# Altium project Xenoponics.PrjPcb
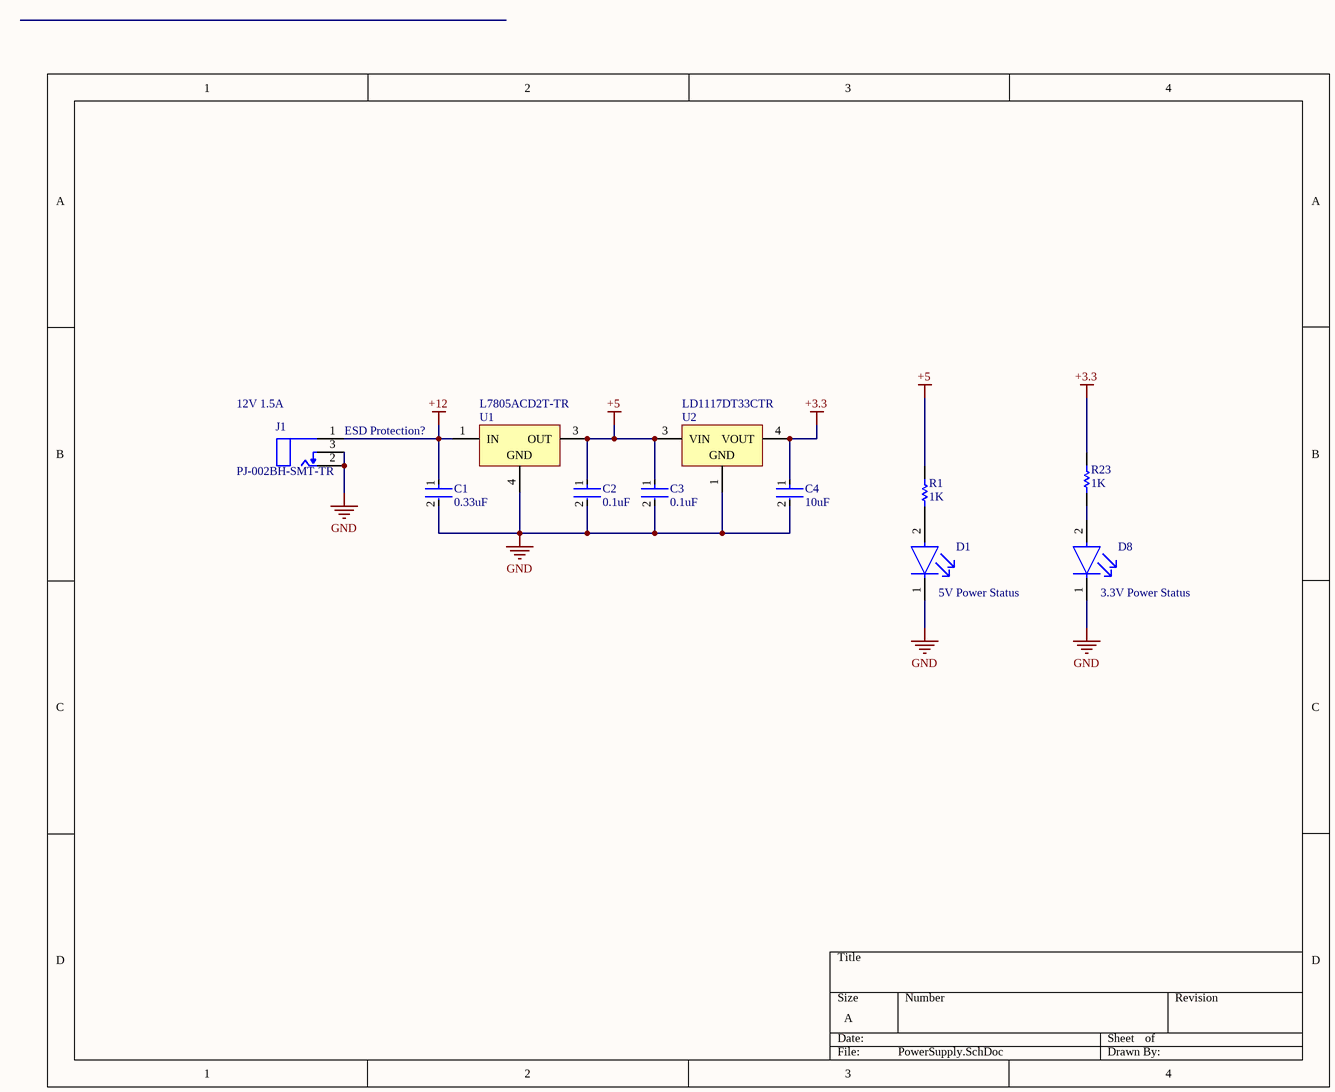
[diagram p0: PowerSupply.SchDoc]
5 sheets, 94 parts. Net scope: global (net labels, ports and power ports of the same name join across sheets).
Board file: Xenoponics.PcbDoc
Sheets:
  PowerSupply.SchDoc
  Processor.SchDoc
  MotorController.SchDoc
  TDS.SchDoc
  PH.SchDoc

## Sheet PowerSupply.SchDoc
size A; SheetNumber: 1; SheetTotal: 5

### Parts
C1  0.33uF  [FP-C0805C-DN-MFG]
C2  0.1uF  [FP-C0805C-DN-MFG]
C3  0.1uF  [FP-C0805C-DN-MFG]
C4  10uF  [FP-C0805C-DG-MFG]
D1  5V Power Status  [FP-LTST-C191TBKT-MFG]
D8  3.3V Power Status  [FP-LTST-C191TBKT-MFG]
J1  PJ-002BH-SMT-TR  [FP-PJ-002BH-SMT-TR-MFG]
R1  1K  [RESC2013X50X30NL20T20]
R23  1K  [RESC2013X50X30NL20T20]
U1  L7805ACD2T-TR  [TO-263_N]
U2  LD1117DT33CTR  [TO-252_M]

### Nets
+3.3: C4.1 R23.2 U2.4(VOUT)
+5: C2.1 C3.1 R1.2 U1.3(OUT) U2.3(VIN)
+12: C1.1 J1.1 U1.1(IN)
GND: C1.2 C2.2 C3.2 C4.2 D1.1(C) D8.1(C) J1.2 J1.3 U1.4(GND) U2.1(GND)
NetD1_2: D1.2(A) R1.1
NetD8_2: D8.2(A) R23.1

### Notes on the sheet
- (near J1) 12V 1.5A
- ESD Protection?

### Library data of the parts
C1 = CMP-1036-04607-3: CAP CER 0.33UF 50V X7R 0805; Manufacturer Part Number: C0805C334K5RACTU; Manufacturer: KEMET; Temperature Coefficient: 30ppm/°C; Value: 0.33 μF; Material: Ceramic; Tolerance: 0.1; Temperature: -55°C to +125°C; Temperature Range Low: -55°C; Voltage Rating: 50 V; Lead Free: Yes; Mouser Description: Multilayer Ceramic Capacitors MLCC - SMD/SMT 50volts 0.33uF 10% X7R; Automotive: No; Package: C0805C-DN; Temperature Characteristic: X7R; Capacitance: 0.33 μF; Digikey Description: CAP CER 0.33UF 50V X7R 0805; Device Class L3: Ceramic Capacitors; Temperature Range High: +125°C; Category: Cap; Ipc Land Pattern Name: CAPC200125X78; ComponentLink2URL: https://content.kemet.com/datasheets/KEM_C1003_C0G_SMD.pdf; ComponentLink2Description: Datasheet; RoHS: TRUE; Device Class L1: Passive Components; Height: 0.88mm; Octopart: https://octopart.com/c0805c334k5ractu-kemet-10475704; Device Class L2: Capacitors
C2 C3 = CMP-2007-00279-2: CAP CER 0.1UF 50V X7R 0805; Manufacturer Part Number: C0805C104K5RACTU; Manufacturer: KEMET; Value: 0.10 μF; Tolerance: 0.1; Temperature Coefficient: 30ppm/°C; Material: Ceramic; Device Class L2: Capacitors; Temperature Range Low: -55°C; Voltage Rating: 50 V; Digikey Description: CAP CER 0.1UF 50V X7R 0805; Category: Cap; ComponentLink2Description: Datasheet; Octopart: https://octopart.com/c0805c104k5ractu-kemet-143926; RoHS: TRUE; ComponentLink2URL: https://content.kemet.com/datasheets/KEM_C1003_C0G_SMD.pdf; Temperature Characteristic: X7R; Temperature: -55°C to +125°C; Height: 0.88mm; Temperature Range High: +125°C; Device Class L1: Passive Components; Automotive: No; Lead Free: Yes; Ipc Land Pattern Name: CAPC200125X78; Device Class L3: Ceramic Capacitors; Mouser Description: Cap Ceramic 0.1uF 50V X7R 10% SMD 2.0 x 1.2 mm 125 C Paper T/R; Capacitance: 0.10 μF; Package: C0805C-DN
C4 = CMP-2007-03243-2: CAP CER 10UF 10V X5R 0805; Manufacturer Part Number: C0805C106K8PACTU; Manufacturer: Kemet; 3DS Part Number: 220-00001; Tolerance: 10%; Temperature Coefficient: 15%; Material: Ceramic; Device Class L2: Capacitors; Device Class L1: Passive Components; ComponentLink2URL: https://content.kemet.com/datasheets/KEM_C1006_X5R_SMD.pdf; Height: 1.4mm; Lead Free: Yes; Digikey Description: CAP CER 10UF 10V X5R 0805; Octopart: https://octopart.com/c0805c106k8pactu-kemet-98697; Capacitance: 10uF; Value: 10uF; Temperature Range Low: -55°C; Temperature: -55°C to +85°C; Automotive: No; Mouser Description: CAP CER 10UF 10V X5R 0805; Ipc Land Pattern Name: CAPC200125X125; Temperature Range High: +85°C; Voltage: 10V; RoHS: TRUE; Device Class L3: Ceramic Capacitors; ComponentLink2Description: Datasheet; Voltage Rating: 10V; Package: C0805C-DG; Temperature Characteristic: X5R; Category: Cap
D1 = CMP-22017-000008-1: LED BLUE CLEAR CHIP SMD; Lens Color: Colorless; Dominant Wavelength: 475nm; Forward Current: 20mA; Wavelength: 468nm; Viewing Angle: 130°; Power Dissipation: 76mW; Luminous Intensity: 180mcd; Number of Elements: 1; Lens Style: Diffused; Forward Voltage: 3.8V; Max Power Dissipation: 75mW; Case Code (Metric): 1608; Packaging: Tape and Reel; Case/Package: 0603; Depth: 1.6mm; Mount: Surface Mount; Lead Free: Lead Free; Min Operating Temperature: -20°C; Lens Transparency: Clear; Illumination Color: Blue; Height: 0.55mm; Test Current: 20mA; Case Code (Imperial): 0603; Reverse Voltage: 5V; Max Operating Temperature: 80°C; Number of Pins: 2; Length: 0.8mm; Radiation Hardening: No; Package Quantity: 1; Number of LEDs: 1; Width: 0.8mm; Color: Blue
D8 = CMP-22017-000008-1: LED BLUE CLEAR CHIP SMD; Lens Color: Colorless; Dominant Wavelength: 475nm; Forward Current: 20mA; Wavelength: 468nm; Viewing Angle: 130°; Power Dissipation: 76mW; Luminous Intensity: 180mcd; Reverse Voltage: 5V; Number of Elements: 1; Lens Style: Diffused; Forward Voltage: 3.8V; Max Power Dissipation: 75mW; Case Code (Metric): 1608; Packaging: Tape and Reel; Case/Package: 0603; Depth: 1.6mm; Mount: Surface Mount; Lead Free: Lead Free; Min Operating Temperature: -20°C; Lens Transparency: Clear; Illumination Color: Blue; Height: 0.55mm; Test Current: 20mA; Case Code (Imperial): 0603; Max Operating Temperature: 80°C; Number of Pins: 2; Length: 0.8mm; Radiation Hardening: No; Package Quantity: 1; Number of LEDs: 1; Width: 0.8mm; Color: Blue
J1 = CMP-2000-06897-2: CONN PWR JACK 2.5X5.5MM SOLDER; Manufacturer: CUI Inc; Current Rating: 5A; Standoff Height: 0.1mm; Voltage Rating: 24V; Conn Gender: Male; Conn Orientation: Right Angle; Number Of Contacts: 3; Temperature Range Low: -25°C; Category: Conn; Package: 0; Device Class L2: Power Connectors; Contact Material: Nickel,Silver; Automotive: No; Mouser Description: 2.5 mm Center Pin, 5.0 A, Right Angle, Surface Mount (SMT), Dc Power Jack Connector; Device Class L3: unset; ComponentLink2URL: https://www.cuidevices.com/product/resource/digikeypdf/pj-002bh-smt-tr.pdf; Octopart: https://octopart.com/pj-002bh-smt-tr-cui-25947151; Manufacturer Part Number: PJ-002BH-SMT-TR; Lead Free: Yes; ComponentLink2Description: Datasheet; Digikey Description: CONN PWR JACK 2.5X5.5MM SOLDER; Height: 11.43mm; Temperature: -25°C to +85°C; RoHS: TRUE; Device Class L1: Connectors; Temperature Range High: +85°C
R1 R23 = CMP-1013-00510-2: Part Number: CRCW08051K00FKEA; Manufacturer: Vishay Dale
U1 = CMP-0244-00214-1: Positive Voltage Regulator, 3-Pin D2PAK, Tape and Reel; DatasheetVersion: 16/11/2011; PackageVersion: 2011; PackageReference: TO-263; PackageDescription: 3-Pin Transistor Outline Package 2.54 mm Pitch, 15.4 mm Lead Span (D2PAK); ComponentLink2URL: http://www.st.com/internet/com/TECHNICAL_RESOURCES/TECHNICAL_LITERATURE/DATASHEET/CD00000444.pdf; ComponentLink1URL: http://www.st.com; ComponentLink1Description: Manufacturer URL; ComponentLink2Description: Datasheet
U2 = CMP-0244-00089-1: Fixed Low Drop Positive Voltage Regulator, 3.3V, 3-Pin DPAK, Tape and Reel; PackageVersion: 2011; ComponentLink1URL: http://www.st.com; DatasheetVersion: 1/11/2011; PackageReference: TO-252; ComponentLink1Description: Manufacturer URL; ComponentLink2URL: http://www.st.com/internet/com/TECHNICAL_RESOURCES/TECHNICAL_LITERATURE/DATASHEET/CD00000544.pdf; ComponentLink2Description: Datasheet; PackageDescription: 3-Pin Transistor Outline Package 2.28 mm Pitch, 9.7 mm Lead Span (DPAK)

## Sheet Processor.SchDoc
size A; SheetNumber: 2; SheetTotal: 5
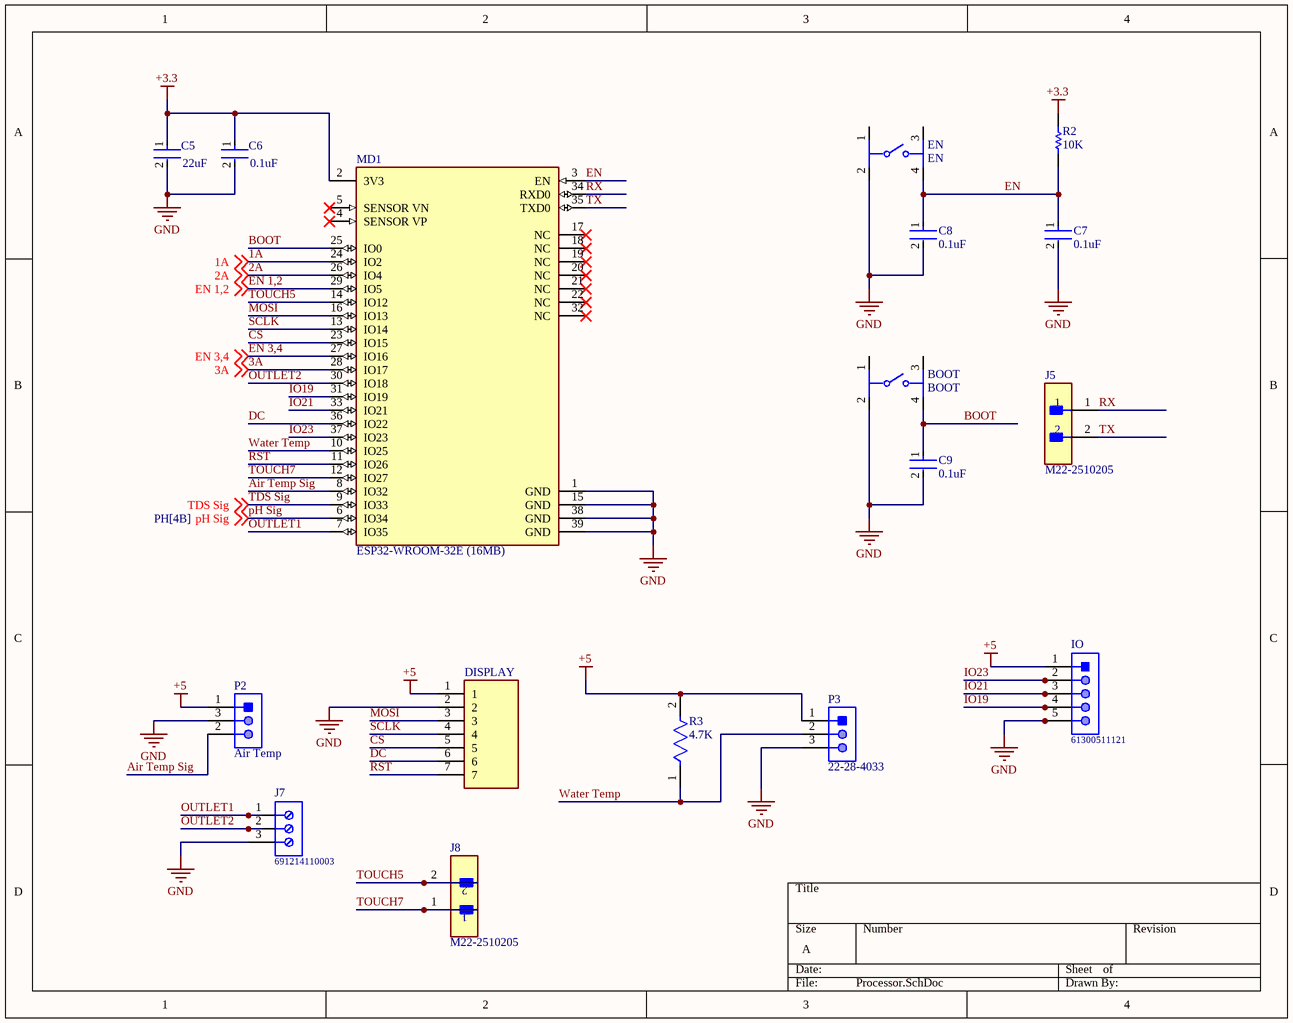
[diagram p1: Processor.SchDoc]

### Parts
BOOT  BOOT  [FP-1825910-2-0]
C5  22uF  [FP-GRM21B-0_15-MFG]
C6  0.1uF  [FP-C0805C-DN-MFG]
C7  0.1uF  [FP-C0805C-DN-MFG]
C8  0.1uF  [FP-C0805C-DN-MFG]
C9  0.1uF  [FP-C0805C-DN-MFG]
DISPLAY  (no value)  [SHDR7W50P0X200_1X7_1590X450X600P]
EN  EN  [FP-1825910-2-0]
IO  61300511121  [61300511121]
J5  M22-2510205  [FP-M22-2510205-MFG]
J7  691214110003  [691214110003]
J8  M22-2510205  [FP-M22-2510205-MFG]
MD1  ESP32-WROOM-32E (16MB)  [FP-ESP32-WROOM-32E_16MB-MFG]
P2  Air Temp  [MOLX-22-28-4033_V]
P3  22-28-4033  [MOLX-22-28-4033_V]
R2  10K  [RESC1609X50X30NL8T20]
R3  4.7K  [FP-CRCW0805-e3-IPC_B]

### Nets
+3.3: C5.1 C6.1 MD1.2(3V3) R2.1
+5: DISPLAY.1 IO.1 P2.1 P3.1 R3.2
GND: BOOT.2 C5.2 C6.2 C7.2 C8.2 C9.2 DISPLAY.2 EN.2 IO.5 J7.3 MD1.1(GND) MD1.15(GND) MD1.38(GND) MD1.39(GND) P2.3 P3.3
1A: MD1.24(IO2) ; off-sheet 1A
2A: MD1.26(IO4) ; off-sheet 2A
3A: MD1.28(IO17) ; off-sheet 3A
Air Temp Sig: MD1.8(IO32) P2.2
BOOT: BOOT.4 C9.1 MD1.25(IO0)
CS: DISPLAY.5 MD1.23(IO15)
DC: DISPLAY.6 MD1.36(IO22)
EN: C7.1 C8.1 EN.4 MD1.3(EN) R2.2
EN 1,2: MD1.29(IO5) ; off-sheet EN 1,2
EN 3,4: MD1.27(IO16) ; off-sheet EN 3,4
IO19: IO.4 MD1.31(IO19)
IO21: IO.3 MD1.33(IO21)
IO23: IO.2 MD1.37(IO23)
MOSI: DISPLAY.3 MD1.16(IO13)
OUTLET1: J7.1 MD1.7(IO35)
OUTLET2: J7.2 MD1.30(IO18)
pH Sig: MD1.6(IO34) ; off-sheet pH Sig
RST: DISPLAY.7 MD1.11(IO26)
RX: J5.1 MD1.34(RXD0)
SCLK: DISPLAY.4 MD1.13(IO14)
TDS Sig: MD1.9(IO33) ; off-sheet TDS Sig
TOUCH5: J8.2 MD1.14(IO12)
TOUCH7: J8.1 MD1.12(IO27)
TX: J5.2 MD1.35(TXD0)
Water Temp: MD1.10(IO25) P3.2 R3.1

Not connected (* = marked no-connect by the designer): BOOT 1 3; EN 1 3; MD1 4(SENSOR_VP)* 5(SENSOR_VN)* 17(NC)* 18(NC)* 19(NC)* 20(NC)* 21(NC)* 22(NC)* 32(NC)*

### Library data of the parts
BOOT EN = CMP-03407-000004-1: SWITCH TACTILE SPST-NO 0.05A 24V; Manufacturer: TE; Manufacturer Part Number: 1825910-2; Contact Current Rating: 50mA; Operating Force: 160gf; Contact Resistance: 100mΩ; Electromechanical Life: 100000Cycles; Package: 0; ComponentLink2Description: Datasheet; Digikey Description: SWITCH TACTILE SPST-NO 0.05A 24V; Octopart: https://octopart.com/1825910-2-te+connectivity-42270502; Temperature Range Low: -35°C; Temperature Range High: +85°C; Lead Free: Yes; Device Class L2: Switches; Automotive: No; Temperature: -35°C to +85°C; Device Class L1: Electromechanical; Category: Switch; ComponentLink2URL: https://www.te.com/commerce/DocumentDelivery/DDEController?Action=showdoc&DocId=Customer+Drawing%7F1825910%7FC10%7Fpdf%7FEnglish%7FENG_CD_1825910_C10.pdf%7F1825910-2; Mount: Through Hole; RoHS: TRUE; Height: 4.6mm; Device Class L3: Tactile Switches; Voltage Rating Dc: 24V; Throw Configuration: SPST-NO
C5 = CMP-2007-03385-2: Chip Multilayer Ceramic Capacitors for General Purpose, 0805, 22uF, X5R, 15%, 20%, 6.3V; Material: Ceramic; Max Operating Temperature: 85°C; Voltage: 6.3V; Min Operating Temperature: -55°C; Case/Package: 0805; Thickness: 0.053inch; Dielectric: X5R; Packaging: Tape and Reel; Depth: 1.25mm; Termination: SMD/SMT; Voltage Rating (DC): 6.3V; Radiation Hardening: No; Tolerance: 20%; Mount: Surface Mount; Lead Free: Lead Free; Package Quantity: 1; REACH SVHC: No SVHC; Voltage Rating: 6.3V; Capacitance: 22uF; Length: 2mm; Case Code (Imperial): 0805; Case Code (Metric): 2012; Width: 0.049inch; Height: 1.25mm
C6-C9 = CMP-2007-00279-2: as C2 on sheet PowerSupply; Device Class L2: Capacitors; Temperature Range Low: -55°C; Voltage Rating: 50 V; Digikey Description: CAP CER 0.1UF 50V X7R 0805; Category: Cap; ComponentLink2Description: Datasheet; Octopart: https://octopart.com/c0805c104k5ractu-kemet-143926; RoHS: TRUE; ComponentLink2URL: https://content.kemet.com/datasheets/KEM_C1003_C0G_SMD.pdf; Temperature Characteristic: X7R; Temperature: -55°C to +125°C; Height: 0.88mm; Temperature Range High: +125°C; Device Class L1: Passive Components; Automotive: No; Lead Free: Yes; Ipc Land Pattern Name: CAPC200125X78; Device Class L3: Ceramic Capacitors; Mouser Description: Cap Ceramic 0.1uF 50V X7R 10% SMD 2.0 x 1.2 mm 125 C Paper T/R; Capacitance: 0.10 μF; Package: C0805C-DN
DISPLAY = B7B-PH-K-S_LF__SN_: Connector; Manufacturer_Name: JST (JAPAN SOLDERLESS TERMINALS); Manufacturer_Part_Number: B7B-PH-K-S(LF)(SN); Datasheet Link: http://uk.rs-online.com/web/p/products/8201440; Height: 6mm; Arrow Part Number: B7B-PH-K-S(LF)(SN); Arrow Price/Stock: https://www.arrow.com/en/products/b7b-ph-k-s-lf-sn/jst-manufacturing
IO = CMP-1502-01068-1: THT Vertical Pin Header WR-PHD, Pitch 2.54 mm, Single Row, 5 pins; Manufacturer: Wurth Elektronik; Pin Number: 5; Contact Resistance: 20mOhm; Working Voltage: 250VAC; Pitch: 2.54mm; Withstanding Voltage: 500VAC; Rated Current: 3A; Gender: Male; Datasheet URL: https://katalog.we-online.de/em/datasheet/6130xx11121.pdf; Orientation: Vertical; Mounting Technology: THT; Row Number: Single; Package Reference: 61300511121; Publisher: WurthElektronik; Part Number: 61300511121; Packaging: Bag; Manufacturer URL: http://www.we-online.de; Operating Temperature: -40to105degC
J5 J8 = CMP-15831-000005-1: CONN HEADER VERT 2POS 2MM; Manufacturer: Harwin; Conn Gender: Male; Current Rating: 2A; Number Of Contacts: 2; Conn Orientation: Vertical; Temperature Range Low: -40°C; Device Class L1: Connectors; ComponentLink2URL: https://cdn.harwin.com/pdfs/C018XX_M22_Series_Connectors.pdf; Temperature Range High: +105°C; Pitch: 2mm; Number Of Rows: 1; Temperature: -40°C to +105°C; Automotive: No; Device Class L3: unset; Octopart: https://octopart.com/m22-2510205-harwin-2538221; Mouser Description: Headers & Wire Housings 2 PIN SIL VERTICAL GOLD PIN HEADER; Height: 5.45mm; Category: Conn; Digikey Description: CONN HEADER VERT 2POS 2MM; Contact Material: Gold,Nickel; Lead Free: Yes; ComponentLink2Description: Datasheet; Manufacturer Part Number: M22-2510205; Device Class L2: Headers and Wire Housings; Package: 0; Footprint Url: https://cdn.harwin.com/pdfs/M22-251.pdf; RoHS: TRUE
J7 = CMP-1502-02466-1: Serie 2141 - 3.50 mm Horizontal Entry Modular with Rising Cage Clamp WR-TBL, 3 pin; Manufacturer: Wurth Elektronik; Pin Number: 3; Pitch: 3.50mm; Package Reference: 691214110003; Mounting Technology: THT; Part Number: 691214110003; Manufacturer URL: http://www.we-online.de; Packaging: Box; Operating Temperature: -40to105degC; Publisher: WurthElektronik; Datasheet URL: http://katalog.we-online.de/em/datasheet/6912141100xx.pdf
MD1 = CMP-194065-000027-1: RX TXRX MOD WIFI TRACE ANT SMD
P2 P3 = CMP-1676-00001-5: Male Header, Pitch 2.54 mm, 1 x 3 Position, Height 8.38 mm, Tail Length 3.18 mm, RoHS, Bulk; Manufacturer: Molex; Rows: 1; Voltage Rating: 250 V; Current Rating: 4 A; Min Operating Temperature: 0 degC; Lead Pitch: 0.1 inch; Packaging: Bulk; Contact Finish: Gold; RoHSCompliant: true; Contact Material: Brass; PackageReference: 22-28-4033; REACH SVHC: Unknown; PackageDescription: Male Header, Pitch 2.54 mm, 1 x 3 Position, Height 8.38 mm, Tail Length 3.18 mm; ComponentLink2URL: http://www.molex.com/pdm_docs/sd/022284033_sd.pdf; Height: 8.38 mm; Mounting Technology: Through Hole; ComponentLink1Description: Manufacturer URL; Length: 7.62 mm; Mount: Through Hole; DatasheetVersion: Rev. G, 01/2012; Max Operating Temperature: 75 degC; ComponentLink2Description: Datasheet; Colour: Black; Pins: 3; Contact Plating: Gold; Package Quantity: 1; ComponentLink1URL: http://www.molex.com/
R2 = CMP-1666-00005-4: Chip Resistor, 10 KOhm, +/- 1%, 100 mW, -55 to 155 degC, 0603 (1608 Metric), RoHS, Tape and Reel; Manufacturer: Vishay Semiconductor; Voltage Rating: 75 V; Max Operating Temperature: 155 degC; PackageDescription: 2-Pin Surface Mount Device, Body 1.575 x 0.85 mm; ComponentLink1Description: Manufacturer URL; RoHSCompliant: true; PackageReference: 0603; REACH SVHC: Unknown; Length: 1.55 mm; DatasheetVersion: 06/2012; Packaging: Tape and Reel; Min Operating Temperature: -55 degC; Mounting Technology: Surface Mount; ComponentLink2URL: https://datasheet.ciiva.com/11809/0900766b80d98afc-11809037.pdf; Height: 0.45 mm; ComponentLink2Description: Datasheet; Package Quantity: 5000; ComponentLink1URL: http://www.vishay.com/
R3 = CMP-2100-03615-2: RES Thick Film, 4.7kΩ, 1%, 0.125W, 100ppm/°C, 0805; Max Power Dissipation: 125mW; Resistance: 4.7kR; Voltage Rating: 150V; Termination: SMD/SMT; Weight: 0.000194oz; Case/Package: 0805; Number of Terminations: 2; Min Operating Temperature: -55°C; Case Code (Metric): 2012; Package Quantity: 10; Depth: 1.25mm; Military Standard: Not; Composition: Thick Film; Radiation Hardening: No; Contact Plating: Tin; Height: 0.45mm; Power Rating: 125mW; Features: Automotive AEC-Q200; Tolerance: 1%; Packaging: Tape and Reel; Max Operating Temperature: 155°C; Length: 2mm; Case Code (Imperial): 0805; Voltage Rating (DC): 150V; Width: 1.25mm; Temperature Coefficient: 100ppm/°C; Lead Free: Lead Free

## Sheet MotorController.SchDoc
size A; SheetNumber: 3; SheetTotal: 5
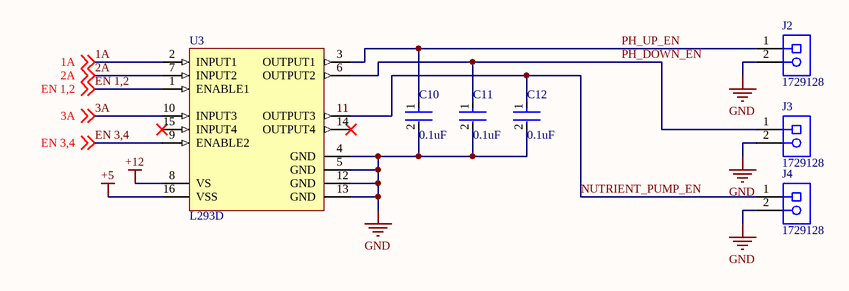
[diagram p2: MotorController.SchDoc]

### Parts
C10  0.1uF  [FP-C0805C-DN-MFG]
C11  0.1uF  [FP-C0805C-DN-MFG]
C12  0.1uF  [FP-C0805C-DN-MFG]
J2  1729128  [PHOE-1729128-2_V]
J3  1729128  [PHOE-1729128-2_V]
J4  1729128  [PHOE-1729128-2_V]
U3  L293D  [STM-L293D-16]

### Nets
+5: U3.16(VSS)
+12: U3.8(VS)
GND: C10.2 C11.2 C12.2 J2.2 J3.2 J4.2 U3.4(GND) U3.5(GND) U3.12(GND) U3.13(GND)
1A: U3.2(INPUT1) ; off-sheet 1A
2A: U3.7(INPUT2) ; off-sheet 2A
3A: U3.10(INPUT3) ; off-sheet 3A
EN 1,2: U3.1(ENABLE1) ; off-sheet EN 1,2
EN 3,4: U3.9(ENABLE2) ; off-sheet EN 3,4
NUTRIENT_PUMP_EN: C12.1 J4.1 U3.11(OUTPUT3)
PH_DOWN_EN: C11.1 J3.1 U3.6(OUTPUT2)
PH_UP_EN: C10.1 J2.1 U3.3(OUTPUT1)

Not connected (* = marked no-connect by the designer): U3 14(OUTPUT4)* 15(INPUT4)*

### Library data of the parts
C10-C12 = CMP-2007-00279-2: as C2 on sheet PowerSupply; Device Class L2: Capacitors; Temperature Range Low: -55°C; Voltage Rating: 50 V; Digikey Description: CAP CER 0.1UF 50V X7R 0805; Category: Cap; ComponentLink2Description: Datasheet; Octopart: https://octopart.com/c0805c104k5ractu-kemet-143926; RoHS: TRUE; ComponentLink2URL: https://content.kemet.com/datasheets/KEM_C1003_C0G_SMD.pdf; Temperature Characteristic: X7R; Temperature: -55°C to +125°C; Height: 0.88mm; Temperature Range High: +125°C; Device Class L1: Passive Components; Automotive: No; Lead Free: Yes; Ipc Land Pattern Name: CAPC200125X78; Device Class L3: Ceramic Capacitors; Mouser Description: Cap Ceramic 0.1uF 50V X7R 10% SMD 2.0 x 1.2 mm 125 C Paper T/R; Capacitance: 0.10 μF; Package: C0805C-DN
J2-J4 = CMP-2000-05815-1: PCB Terminal Block, 13.5 A, 400 V, 2-Pin THD, RoHS, Bulk; Manufacturer: Phoenix Contact; Package Version: 03/2015; No. of Rows: 1; Pitch: 5.08mm; No. of Positions: 2; Voltage Rating: 400V; Current Rating: 13500mA; Manufacturer URL: http://www.phoenixcontact.com/; Datasheet URL: https://datasheet.ciiva.com/16046/1729128-16046181.pdf; RoHS: TRUE; Package URL: https://www.phoenixcontact.com/online/portal/pi/pxc/product_detail_page/!ut/p/b1/3VdJjqNKFDxLH8AFycySyWY2ozFsEPOMMQaDOX1XedGL_1Vdm5YXJleknhSKeBkvI6EA8ncAo3AYoDhBQGco6KN7VURTdemj9us_IEKEZo_YHiPAEWEFmDGOHMORkqKYCORBZxgL7ZoaZYcbFFUZ3fqxSY6GOuxydWUuHqz1ynmMFygu583Bob0Ewr6Sd_l-5m-kAueHiB0jpRwZwe58wwtkpxtMYd_LmGcDRU02dRNEyWt6Y2ti5pSyJ_reIkzIulrqApdnbT11V5jnCKbYNCvhEM1MCpPByat_X379-iThf08CI5GfOPqfBeS3BRoBOdD55AKVv0iLwCMq-2BrzXWSGRH7pUGD9uwXQjiph3xL0DKQwdGa0JImiIOmBNOestqgwTHSSs2oOep-78apyXQBvNi8ZLaFjvjWvcaUEBu0MC6Wbe-d6mB0FAebo2lUWinqYaZs5DAYzV0RP9yitUjnGJ0iI9xhZkT42OCQNUJJhkgWINNQLP2JFP6OpMg3JCVg70jqHT0lvKOnhHf0lPuOnnLf0VPuWx6_dxwUIvwk5WMkT0kLL1mh61l2yZVSzG3pYV_bqo-mj6uMKwKwdnnW8Jh5RTOJzMOA5c-eJDaZQw4mTMPH02PvS_ZAqNVjVTo2WyYLkwH_KU1mmmG5kjRhDqPXLwwVHvVOjCM60-fpXvTDfMGW1PVFVS1r4e4yVDk4ZdNbkUHvqPqQSeian4UD39fNKmachqdJ1NJbyk8rXT9mXTvPk3oE5meulKGgiruPJek-4I9hTT6G8ZLOyRSm2RRVbThERQad5OS28hdt4YW4vG0stgYYzsWsK4_7y6DZMjJSCqri1kyiZR5vD7pwIrNR7QwPHTcLTI5qT7eRlpHrdGiupYlqQDJ7zy_CND8fWWBoLRXxk1RVcXiBQwbTD4Xi7KL-FuO94t9xaqweXzH; PartNumber: 1729128; Package Description: 2-Pin Through Hole Device, Body 8.1 x 10.16 mm, Pitch 5.08 mm; Datasheet Version: 12/2013; Mounting Technology: ThroughHole; Orientation: Horizontal; Package Reference: 1729128-2; Packing: Bulk
U3 = CMP-2000-06524-1: Push-Pull Four Channel Driver with Diode, 4.5 to 36 V, -40 to 150 degC, 16-Pin PDIP, RoHS, Tube; Manufacturer: STMicroelectronics; Number of Outputs: 4; Current - Peak Output: 1.2A; Current - Output / Channel: 600mA; Input Type: Non-Inverting; Other Related Documents: L293DViewAllSpecifications; Dynamic Catalog: HalfBridge; Voltage - Supply: 4.5V~36V; Other Names: 497-2936-5; Package / Case: 16-DIP(0.300",7.62mm); PartNumber: L293D; Operating Temperature: -40°C~150°C; Datasheet URL: http://www.st.com/st-web-ui/static/active/en/resource/technical/document/datasheet/CD00000059.pdf; Supplier Device Package: 16-PowerDIP; Packaging: Tube; Package Description: 16-Pin Thru-Hole Dual-In-Line, Body 20 x 6.85 mm, Pitch 2.54 mm; Standard Package: 25; Datasheet Version: 07/2003; On-State Resistance: -; Manufacturer URL: http://www.st.com/; Category: IntegratedCircuits(ICs); Family: PMIC-MOSFET,BridgeDrivers-InternalSwitch; Type: HalfBridge; Series: -; Mounting Technology: ThroughHole; Package Reference: DIP-16; Mounting Type: ThroughHole

## Sheet TDS.SchDoc
size A; SheetNumber: 4; SheetTotal: 5; SPICEModelCacheXQVYIPPJ: <root> / <DocumentId>XQVYIPPJ</DocumentId> / <CacheFrame Number="0"> / <Model Name="umk107bj105_a-t" Kind="CKT"> / <Text>* UMK107BJ105_A-T     SPICE MODEL  ( General Type ) / *-------------------------------------------------------------------------------------------------------- / * Model Generated by TAIYO YUDEN Corporation (http://www.ty-top.com) / * Version 1.0 / * TAIYO YUDEN Control No. 170508_130520 / * Copyright(c) 2012 TAIYO YUDEN CO.,LTD. All Rights Reserved. / *-------------------------------------------------------------------------------------------------------- / * / * Products Name : Multilayer Ceramic Capacitors / * / * Characteristics : / *     Capacitance : 1 uF , Rated Voltage : 50V , TCC : X5R / *     Case Size : 1.6 x 0.8 / 0.063 x 0.031 [mm/inch] , Thickness : 0.8 / 0.031 [mm/inch] / *     (Conditions: Temperature = 25 degC , DC Bias Current/Voltage = 0A / 0V) / * / * Frequency Range : 40Hz - 3GHz / * / * External Node Assignments : / * / *  1  o---| |---o  2 / * / *-------------------------------------------------------------------------------------------------------- / .SubCkt UMK107BJ105_A-T 1 2 / **************************** / C0 1 110 0.79929u / Cm 1 101 0.13681u / C1 101 102 0.26224u / Rc1 101 102 5.8806k / C2 102 103 0.057839u / Rc2 102 103 469.42 / C3 103 110 0.014568u / Rc3 103 110 14.853 / C2m 1 301 0.13283u / C21 301 302 1.2593u / Rc21 301 302 6.3079k / C22 302 303 1.1189u / Rc22 302 303 6.9405k / C23 303 304 1.1421u / Rc23 303 304 6.4848k / C24 304 305 0.36861u / Rc24 304 305 785 / C25 305 306 0.39327u / Rc25 305 306 637.41 / C26 306 307 0.27451u / Rc26 306 307 19.365 / C27 307 308 0.15295u / Rc27 307 308 23.239 / C28 308 309 0.17569u / Rc28 308 309 17.788 / C29 309 110 1420.6p / Rc29 309 110 1.9725 / Rp0 1 110 500Meg / L0 110 120 0.24088n / Lm 120 130 0.1369n / L1 120 121 0.1842n / RL1 121 130 0.29804 / L2 120 122 0.40657n / RL2 122 130 0.57395 / L3 120 123 0.85773n / RL3 123 130 0.82282 / CR 120 124 0.11463u / LR 124 125 0.25983n / RR 125 130 52.447m / CL 130 140 1.4637p / LL 130 140 0.23986n / RL 130 140 33.985 / Rs 140 2 6.8539m / **************************** / .ends UMK107BJ105_A-T</Text> / </Model> / </CacheFrame> / </root>
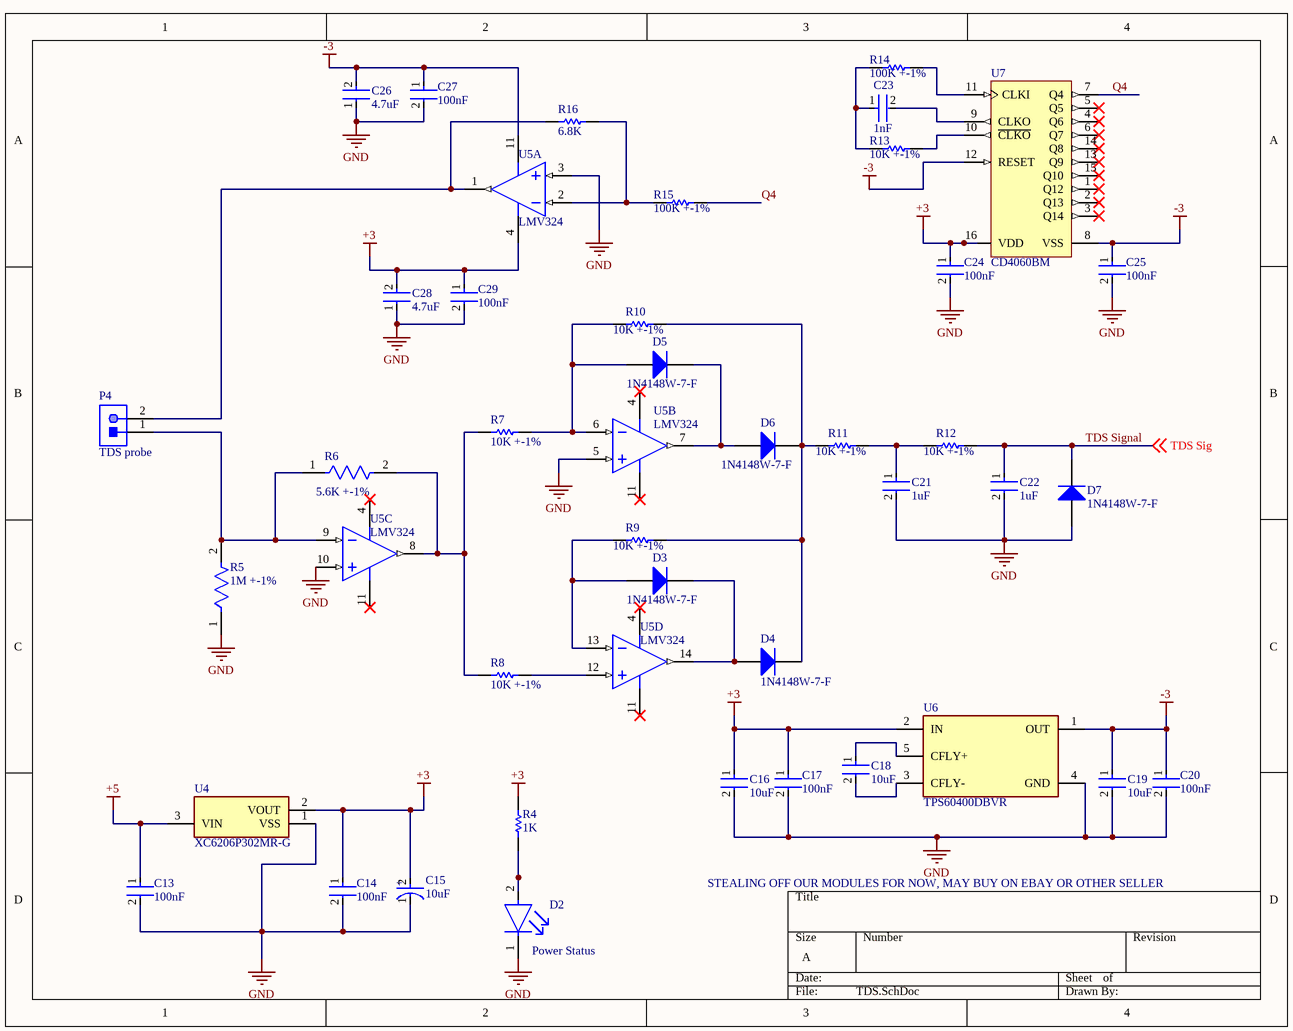
[diagram p3: TDS.SchDoc]

### Parts
C13  100nF  [FP-CGA3E-0_3-0_1-IPC_A]
C14  100nF  [FP-CGA3E-0_3-0_1-IPC_A]
C15  10uF  [FP-T491C106K016AT-MFG]
C16  10uF  [FP-C0805C-DG-MFG]
C17  100nF  [FP-CGA3E-0_3-0_1-IPC_A]
C18  10uF  [FP-C0805C-DG-MFG]
C19  10uF  [FP-C0805C-DG-MFG]
C20  100nF  [FP-CGA3E-0_3-0_1-IPC_A]
C21  1uF  [FP-0603-L_1_6_0_1-W_0_8_0-IPC_A]
C22  1uF  [FP-0603-L_1_6_0_1-W_0_8_0-IPC_A]
C23  1nF  [FP-0603-L_1_6_0_15-W_0_81-IPC_A]
C24  100nF  [FP-CGA3E-0_3-0_1-IPC_A]
C25  100nF  [FP-CGA3E-0_3-0_1-IPC_A]
C26  4.7uF  [FP-GRM188-0_1-MFG]
C27  100nF  [FP-CGA3E-0_3-0_1-IPC_A]
C28  4.7uF  [FP-GRM188-0_1-MFG]
C29  100nF  [FP-CGA3E-0_3-0_1-IPC_A]
D2  Power Status  [FP-LTST-C191TBKT-MFG]
D3  1N4148W-7-F  [DIOD-SOD123-2_V]
D4  1N4148W-7-F  [DIOD-SOD123-2_V]
D5  1N4148W-7-F  [DIOD-SOD123-2_V]
D6  1N4148W-7-F  [DIOD-SOD123-2_V]
D7  1N4148W-7-F  [DIOD-SOD123-2_V]
P4  TDS probe  [JST-S2B-PH-K-S_V]
R4  1K  [RESC2013X50X30NL20T20]
R5  1M +-1%  [FP-CRCW0603-e3-MFG]
R6  5.6K +-1%  [FP-CRCW0603-e3-MFG]
R7  10K +-1%  [RESC1609X50X30NL8T20]
R8  10K +-1%  [RESC1609X50X30NL8T20]
R9  10K +-1%  [RESC1609X50X30NL8T20]
R10  10K +-1%  [RESC1609X50X30NL8T20]
R11  10K +-1%  [RESC1609X50X30NL8T20]
R12  10K +-1%  [RESC1609X50X30NL8T20]
R13  10K +-1%  [RESC1609X50X30NL8T20]
R14  100K +-1%  [RESC1608X55X30ML20T20]
R15  100K +-1%  [RESC1608X55X30ML20T20]
R16  6.8K  [RESC1609X50X30LL10T20]
U4  XC6206P302MR-G  [SOT95P280X130-3N]
U5  LMV324  [D0014A_V]  (parts A,B,C,D of 4)
U6  TPS60400DBVR  [FP-DBV0005A-IPC_B]
U7  CD4060BM  [D0016A_M]

### Nets
+3: C14.1 C15.2(A) C16.1 C17.1 C24.1 C28.2 C29.1 R4.2 U4.2(VOUT) U5.4(VCC+) U6.2(IN) U7.16(VDD)
+5: C13.1 U4.3(VIN)
-3: C19.1 C20.1 C25.1 C26.2 C27.1 U5.11(GND) U6.1(OUT) U7.8(VSS) U7.12(RESET)
GND: C13.2 C14.2 C15.1(C) C16.2 C17.2 C19.2 C20.2 C21.2 C22.2 C24.2 C25.2 C26.1 C27.2 C28.1 C29.2 D2.1(C) D7.1(A) R5.1 U4.1(VSS) U5.3(1IN+) U5.5(2IN+) U5.10(3IN+) U6.4(GND)
Q4: R15.2 U7.7(Q4)
TDS Sig: C22.1 D7.2(K) R12.2 ; off-sheet TDS Sig  [also labelled TDS Signal]
NetC18_1: C18.1 U6.5(CFLY+)
NetC18_2: C18.2 U6.3(CFLY-)
NetC21_1: C21.1 R11.2 R12.1
NetC23_1: C23.1 R13.1 R14.1
NetC23_2: C23.2 U7.9(CLKO)
NetD2_2: D2.2(A) R4.1
NetD3_1: D3.1(A) R9.1 U5.13(4IN-)
NetD3_2: D3.2(K) D4.1(A) U5.14(4OUT)
NetD4_2: D4.2(K) D6.2(K) R9.2 R10.2 R11.1
NetD5_1: D5.1(A) R7.2 R10.1 U5.6(2IN-)
NetD5_2: D5.2(K) D6.1(A) U5.7(2OUT)
NetP4_1: P4.1 R5.2 R6.1 U5.9(3IN-)
NetP4_2: P4.2 R16.1 U5.1(1OUT)
NetR6_2: R6.2 R7.1 R8.1 U5.8(3OUT)
NetR8_2: R8.2 U5.12(4IN+)
NetR13_2: R13.2 U7.10(~{CLKO})
NetR14_2: R14.2 U7.11(CLKI)
NetR15_1: R15.1 R16.2 U5.2(1IN-)

Not connected (* = marked no-connect by the designer): U7 1(Q12)* 2(Q13)* 3(Q14)* 4(Q6)* 5(Q5)* 6(Q7)* 13(Q9)* 14(Q8)* 15(Q10)*

### Notes on the sheet
- STEALING OFF OUR MODULES FOR NOW, MAY BUY ON EBAY OR OTHER SELLER
- (in symbol CMP-2000-07197-3) +

### Library data of the parts
C13 C14 C17 C20 C24 C25 C27 C29 = CMP-2000-07546-2: Cap Ceramic 100nF 50V X7R 10% Pad SMD 0603 +125°C Automotive T/R; Weight: 7.1E-05oz; Composition: Ceramic; Max Operating Temperature: 125°C; Termination: SMD/SMT; Dielectric: X7R; Length: 1.6mm; Package Quantity: 1; REACH SVHC: No SVHC; Lead Free: Lead Free; Case Code (Metric): 1608; Min Operating Temperature: -55°C; Packaging: Tape and Reel; Tolerance: 10%; Voltage Rating: 50V; Case Code (Imperial): 0603; Capacitance: 100nF; Case/Package: 0603; Voltage Rating (DC): 50V; Depth: 0.8mm; Radiation Hardening: No; Ratings: AEC-Q200; Mount: Surface Mount; Voltage: 50V; Thickness: 0.035inch; Width: 0.8mm; Height: 0.8mm
C15 = CMP-2000-07197-3: CAP TANT 10UF 10% 16V 2312; Dielectric Material: Tantalum; Polarity: Polar; Dissipation Factor: 6%; Leakage Current: 1.6uA; Ripple Current: 247mA; Life (Hours): 2000Hour; ESR (Equivalent Series Resistance): 1.8R; Height: 2.5mm; Length: 6mm; Min Operating Temperature: -55°C; Case/Package: Molded; Voltage: 16V; Height - Seated (Max): 0.11inch; Package Quantity: 1; RoHS Compliant: Yes; Termination: SMD/SMT; REACH SVHC: No SVHC; Case Code (Imperial): 2312; Tolerance: 10%; Capacitance: 10uF; Voltage Rating (DC): 16V; Mount: Surface Mount; Radiation Hardening: No; Case Code (Metric): 6032; Packaging: Tape and Reel; Depth: 3.2mm; Width: 3.2mm; Max Operating Temperature: 125°C; Features: General Purpose; Voltage Rating: 16V; Lead Free: Lead Free
C16 C18 C19 = CMP-2007-03243-2: as C4 on sheet PowerSupply; Device Class L2: Capacitors; Device Class L1: Passive Components; ComponentLink2URL: https://content.kemet.com/datasheets/KEM_C1006_X5R_SMD.pdf; Height: 1.4mm; Lead Free: Yes; Digikey Description: CAP CER 10UF 10V X5R 0805; Octopart: https://octopart.com/c0805c106k8pactu-kemet-98697; Capacitance: 10uF; Value: 10uF; Temperature Range Low: -55°C; Temperature: -55°C to +85°C; Automotive: No; Mouser Description: CAP CER 10UF 10V X5R 0805; Ipc Land Pattern Name: CAPC200125X125; Temperature Range High: +85°C; Voltage: 10V; RoHS: TRUE; Device Class L3: Ceramic Capacitors; ComponentLink2Description: Datasheet; Voltage Rating: 10V; Package: C0805C-DG; Temperature Characteristic: X5R; Category: Cap
C21 C22 = CMP-2000-05447-3: None; Tolerance: 10%; Voltage Rating: 50V; Dielectric: X5R; Height: 0.8mm; Depth: 0.8mm; Number of Pins: 2; Length: 1.6mm; Thickness: 0.035inch; Contact Plating: Nickel; Radiation Hardening: No; Package Quantity: 1; Case/Package: 0603; Capacitance: 1uF; Halogen Free: Halogen Free; RoHS Compliant: Yes; Termination: SMD/SMT; Max Operating Temperature: 85°C; Min Operating Temperature: -55°C; Case Code (Metric): 1608; Construction: Flat; Voltage Rating (DC): 50V; Packaging: Tape and Reel; Series: M; Case Code (Imperial): 0603; Width: 0.031inch; Mount: Surface Mount
C23 = CMP-2006-04378-2: General Purpose Ceramic Capacitor, 0603, 1nF, 10%, X7R, 15%, 50V; Case Code (Metric): 1608; Min Operating Temperature: -55°C; Weight: 7.1E-05oz; Series: -; Capacitance: 1nF; RoHS Compliant: Yes; Radiation Hardening: No; Height: 0.9mm; Mount: Surface Mount; REACH SVHC: No SVHC; Lead Free: Lead Free; Depth: 0.81mm; Voltage: 50V; Number of Pins: 2; Voltage Rating: 50V; Max Operating Temperature: 125°C; Termination: SMD/SMT; Construction: Flat; Case Code (Imperial): 0603; Dielectric: X7R; Width: 0.032inch; Tolerance: 10%; Case/Package: 0603; Contact Plating: Tin; Packaging: Tape and Reel; Voltage Rating (DC): 50V; Dielectric Material: Ceramic; Package Quantity: 4000; Thickness: 0.035inch; Length: 1.6mm
C26 C28 = CMP-2006-02799-3: CAP CER 4.7UF 6.3V X5R 0603; Material: Ceramic; Tolerance: 10%; Max Operating Temperature: 85°C; REACH SVHC: No SVHC; Thickness: 0.035inch; Voltage Rating: 6.3V; Package Quantity: 1; Radiation Hardening: No; Capacitance: 4.7uF; Voltage: 6.3V; Case Code (Metric): 1608; Dielectric: X5R; Mount: Surface Mount; RoHS Compliant: Yes; Height: 0.8mm; Voltage Rating (DC): 6.3V; Width: 0.8mm; Lead Free: Lead Free; Case Code (Imperial): 0603; Packaging: Tape and Reel; Length: 1.6mm; Case/Package: 0603; Termination: SMD/SMT; Min Operating Temperature: -55°C; Depth: 0.8mm
D2 = CMP-22017-000008-1: as D8 on sheet PowerSupply; Case Code (Metric): 1608; Packaging: Tape and Reel; Case/Package: 0603; Depth: 1.6mm; Mount: Surface Mount; Lead Free: Lead Free; Min Operating Temperature: -20°C; Lens Transparency: Clear; Illumination Color: Blue; Height: 0.55mm; Test Current: 20mA; Case Code (Imperial): 0603; Max Operating Temperature: 80°C; Number of Pins: 2; Length: 0.8mm; Radiation Hardening: No; Package Quantity: 1; Number of LEDs: 1; Width: 0.8mm; Color: Blue
D3-D7 = CMP-2000-04932-2: Fast Switching Diode, 100 V, 0.15 A, -65 to 150 degC, 2-Pin?SOD123, RoHS, Tape and Reel; Recovery Time: 4ns; Brand: DiodesIncorporated; Unit Weight: 0.000353oz; Max Surge Current: 2A; Peak Reverse Voltage: 100V; Ir - Reverse Current: 1uA; Vf - Forward Voltage: 1.25V; Configuration: Single; If - Forward Current: 0.15A; Product Category: Diodes-GeneralPurpose,Power,Switching; Operating Temperature Range: -65Cto+150C; Packaging: Reel; Manufacturer URL: http://www.diodes.com/; Maximum Operating Temperature: +150C; Height: 1.25mm; Minimum Operating Temperature: -65C; Product: SwitchingDiodes; Package URL: http://www.diodes.com/datasheets/ds18004.pdf; Type: SwitchingDiode; Package Reference: SOD123-2; Width: 1.7mm; Datasheet URL: http://www.farnell.com/datasheets/1915529.pdf; Datasheet Version: Rev. 24-2, 10/2013; Series: 1N4148; Factory Pack Quantity: 3000; Length: 2.85mm; RoHS: True; Manufacturer: DiodesIncorporated; Mounting Style: SMD/SMT; Package / Case: SOD-123
P4 = CMP-1755-00004-1: Male Header, Pitch 2 mm, 1 x 2 Position, Height 4.8 mm, Tail Length 3.4 mm, -25 to 85 degC, RoHS, Bulk; Case\Package: Radial; Tolerance: 20%; Capacitance: 10 uF; Voltage Rating (DC): 50 V; Packaging: Bulk; ComponentLink1URL: http://www.jst-mfg.com/product/pdf/eng/ePH.pdf; Radiation Hardening: No; Height: 11 mm; Package Quantity: 200; PackageDescription: Male Header, Pitch 2 mm, 1 x 2 Position, Height 4.8 mm, Tail Length 3.4 mm; PackageReference: S2B-PH-K-S; Diameter: 5 mm; Pins: 2; Mount: Through Hole; Max Operating Temperature: 85 degC; Min Operating Temperature: -40 degC; ComponentLink1Description: Datasheet; DatasheetVersion: Dec-12; Length: 11 mm; Lead Pitch: 2 mm; REACH SVHC: No SVHC; Voltage Rating: 50 V; RoHSCompliant: true
R4 = CMP-1013-00510-2: as R1 on sheet PowerSupply
R5 = CMP-2000-03013-2: RES Thick Film, 1MΩ, 1%, 0.1W, 100ppm/°C, 0603; Max Power Dissipation: 100mW; Resistance: 1MR; Voltage Rating (DC): 75V; Depth: 0.85mm; Max Operating Temperature: 155°C; Length: 1.55mm; Power Rating: 100mW; Military Standard: Not; Features: Automotive AEC-Q200; Min Operating Temperature: -55°C; Number of Pins: 2; Mount: Surface Mount; Package Quantity: 10; Packaging: Tape and Reel; Height: 0.45mm; Radiation Hardening: No; Case Code (Metric): 1608; Temperature Coefficient: 100ppm/°C; Width: 0.85mm; Composition: Thick Film; Termination: SMD/SMT; Tolerance: 1%; Number of Terminations: 2; Lead Free: Lead Free; Contact Plating: Tin; Case/Package: 0603; Weight: 7.1E-05oz; Voltage Rating: 75V; Case Code (Imperial): 0603
R6 = CMP-2000-03487-2: RES Thick Film, 5.6kΩ, 1%, 0.1W, 100ppm/°C, 0603; Voltage Rating: 75V; Power Rating: 100mW; Resistance: 5.6kR; Packaging: Tape and Reel; Case/Package: 0603; Depth: 0.85mm; Package Quantity: 5000; Working Voltage: 75V; Case Code (Metric): 1608; Height: 0.45mm; Voltage Rating (DC): 75V; Tolerance: 1%; Number of Pins: 2; Weight: 7.1E-05oz; Composition: Thick Film; Width: 0.85mm; Temperature Coefficient: 100ppm/°C; Min Operating Temperature: -55°C; Radiation Hardening: No; Contact Plating: Tin; Case Code (Imperial): 0603; Max Operating Temperature: 155°C; Mount: Surface Mount; Length: 1.55mm; Lead Free: Lead Free; Military Standard: Not; Number of Terminations: 2; Termination: SMD/SMT
R7-R13 = CMP-1666-00005-4: as R2 on sheet Processor; Max Operating Temperature: 155 degC; PackageDescription: 2-Pin Surface Mount Device, Body 1.575 x 0.85 mm; ComponentLink1Description: Manufacturer URL; RoHSCompliant: true; PackageReference: 0603; REACH SVHC: Unknown; Length: 1.55 mm; DatasheetVersion: 06/2012; Packaging: Tape and Reel; Min Operating Temperature: -55 degC; Mounting Technology: Surface Mount; ComponentLink2URL: https://datasheet.ciiva.com/11809/0900766b80d98afc-11809037.pdf; Height: 0.45 mm; ComponentLink2Description: Datasheet; Package Quantity: 5000; ComponentLink1URL: http://www.vishay.com/
R14 R15 = CMP-2000-00875-1: Part Number: ERA3AEB104V; Manufacturer: Panasonic
R16 = CMP-2000-03550-1: Part Number: CRCW06036K80FKEA; Manufacturer: Vishay Dale
U4 = XC6206P302MR-G: Integrated Circuit; Manufacturer_Name: Torex; Datasheet Link: https://www.torexsemi.com/file/xc6206/XC6206.pdf; Height: 1.3mm; Manufacturer_Part_Number: XC6206P302MR-G; Mouser Part Number: 865-XC6206P302MR-G; Mouser Price/Stock: https://www.mouser.co.uk/ProductDetail/Torex-Semiconductor/XC6206P302MR-G?qs=AsjdqWjXhJ%2FCPGHa4B8pZA%3D%3D
U5 = CMP-1685-00010-1: Quad Low-Voltage Rail-to-Rail Output Operational Amplifier, 2.7 to 5.5 V, -40 to 125 degC, 14-Pin SOIC (D), Green (RoHS & no Sb/Br), Tape and Reel; ComponentLink3Description: Package Specification; ComponentLink2URL: http://www.ti.com/lit/ds/symlink/lmv324.pdf; ComponentLink3URL: http://www.ti.com/lit/ml/mpds177g/mpds177g.pdf; DatasheetVersion: SLOS263W, 10/2014; ComponentLink1URL: http://www.ti.com/; Code_JEDEC: MS-012; ComponentLink1Description: Manufacturer URL; PackageDescription: 14-Pin Small Outline Integrated Circuit, Body 8.65 x 3.9 mm, Pitch 1.27 mm; PackageReference: D0014A; ComponentLink2Description: Datasheet
U6 = CMP-0391-00019-3: IC REG CHARG PUMP INV 60MA SOT23; Number of Outputs: 1; Min Supply Voltage: 1.8V; Max Supply Voltage: 5.25V; Max Output Voltage: -5.25V; Operating Supply Current: 125uA; Logic Function: Inverting; Min Output Voltage: -1.6V; Output Type: Adjustable; Switching Frequency: 250kHz; Synchronous Rectifier: No; Min Operating Temperature: -40°C; Number of Pins: 5; Package Quantity: 3000; Min Input Voltage: 1.8V; Max Operating Temperature: 85°C; Packaging: Tape and Reel; Output Current: 60mA; Max Input Voltage: 5.25V; Weight: 0.000459oz; Lead Free: Lead Free; Output Voltage: -5.25V; Contact Plating: Gold; Radiation Hardening: No; Quiescent Current: 125uA; Max Output Current: 60mA; REACH SVHC: No SVHC; Case/Package: SOT-23-5
U7 = CMP-1086-00003-4: CMOS 14-Stage Ripple Carry Binary Counter / Divider and Oscillator, 3 to 18 V, -55 to 125 degC, 16-Pin SOIC (D), Green (RoHS & no Sb/Br), Tube; Manufacturer: Texas Instruments; VDD: 3 to 18 V; tPHL, tPLH (typ) @ 5 V: 370 ns; PartNumber: CD4060BM; ComponentLink3Description: Package Specification; ComponentLink1Description: Manufacturer URL; ComponentLink2URL: http://www.ti.com/lit/ds/symlink/cd4060b.pdf; Mounting Technology: Surface Mount; PackageDescription: 16-Pin Plastic Small-Outline Package, Body 9.9 x 3.9 mm, Pitch 1.27 mm; ComponentLink2Description: Datasheet; ComponentLink1URL: http://www.ti.com; PackageReference: D0016A; Temperature Range: -55 to 125 degC; ComponentLink3URL: http://www.ti.com/lit/ml/mpds178g/mpds178g.pdf; PackageVersion: 4040047-6/M; Note1: Green (RoHS & no Sb/Br); Packing: Tube; DatasheetVersion: SCHS049C

## Sheet PH.SchDoc
size A; SheetNumber: 5; SheetTotal: 5; SPICEModelCacheLCDKWDOD: <root> / <DocumentId>LCDKWDOD</DocumentId> / <CacheFrame Number="0"> / <Model Name="umk107bj105_a-t" Kind="CKT"> / <Text>* UMK107BJ105_A-T     SPICE MODEL  ( General Type ) / *-------------------------------------------------------------------------------------------------------- / * Model Generated by TAIYO YUDEN Corporation (http://www.ty-top.com) / * Version 1.0 / * TAIYO YUDEN Control No. 170508_130520 / * Copyright(c) 2012 TAIYO YUDEN CO.,LTD. All Rights Reserved. / *-------------------------------------------------------------------------------------------------------- / * / * Products Name : Multilayer Ceramic Capacitors / * / * Characteristics : / *     Capacitance : 1 uF , Rated Voltage : 50V , TCC : X5R / *     Case Size : 1.6 x 0.8 / 0.063 x 0.031 [mm/inch] , Thickness : 0.8 / 0.031 [mm/inch] / *     (Conditions: Temperature = 25 degC , DC Bias Current/Voltage = 0A / 0V) / * / * Frequency Range : 40Hz - 3GHz / * / * External Node Assignments : / * / *  1  o---| |---o  2 / * / *-------------------------------------------------------------------------------------------------------- / .SubCkt UMK107BJ105_A-T 1 2 / **************************** / C0 1 110 0.79929u / Cm 1 101 0.13681u / C1 101 102 0.26224u / Rc1 101 102 5.8806k / C2 102 103 0.057839u / Rc2 102 103 469.42 / C3 103 110 0.014568u / Rc3 103 110 14.853 / C2m 1 301 0.13283u / C21 301 302 1.2593u / Rc21 301 302 6.3079k / C22 302 303 1.1189u / Rc22 302 303 6.9405k / C23 303 304 1.1421u / Rc23 303 304 6.4848k / C24 304 305 0.36861u / Rc24 304 305 785 / C25 305 306 0.39327u / Rc25 305 306 637.41 / C26 306 307 0.27451u / Rc26 306 307 19.365 / C27 307 308 0.15295u / Rc27 307 308 23.239 / C28 308 309 0.17569u / Rc28 308 309 17.788 / C29 309 110 1420.6p / Rc29 309 110 1.9725 / Rp0 1 110 500Meg / L0 110 120 0.24088n / Lm 120 130 0.1369n / L1 120 121 0.1842n / RL1 121 130 0.29804 / L2 120 122 0.40657n / RL2 122 130 0.57395 / L3 120 123 0.85773n / RL3 123 130 0.82282 / CR 120 124 0.11463u / LR 124 125 0.25983n / RR 125 130 52.447m / CL 130 140 1.4637p / LL 130 140 0.23986n / RL 130 140 33.985 / Rs 140 2 6.8539m / **************************** / .ends UMK107BJ105_A-T</Text> / </Model> / </CacheFrame> / </root>
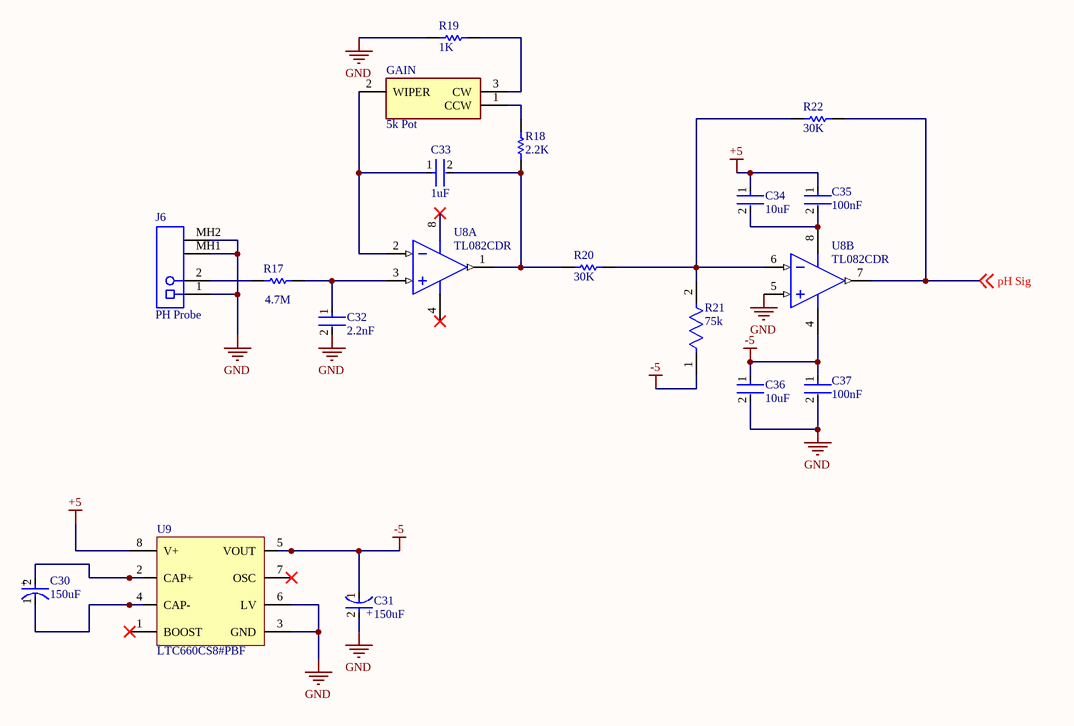
[diagram p4: PH.SchDoc]

### Parts
C30  150uF  [FP-POSCAP-D3L-MFG]
C31  150uF  [FP-POSCAP-D3L-MFG]
C32  2.2nF  [FP-GRM188-0_1-e0_2_0_5-MFG]
C33  1uF  [FP-0603-L_1_6_0_1-W_0_8_0-IPC_A]
C34  10uF  [FP-C0805C-DG-MFG]
C35  100nF  [FP-CGA3E-0_3-0_1-IPC_A]
C36  10uF  [FP-C0805C-DG-MFG]
C37  100nF  [FP-CGA3E-0_3-0_1-IPC_A]
GAIN  5k Pot  [3296Y1502LF]
J6  PH Probe  [TECO-1-1337543-0_V]
R17  4.7M  [RESC1609X50X30LL10T20]
R18  2.2K  [RESC1608X55X30ML20T20]
R19  1K  [RESC2013X50X30NL20T20]
R20  30K  [RESC1609X50X30LL10T20]
R21  75k  [FP-ERA3A-MFG]
R22  30K  [RESC1609X50X30LL10T20]
U8  TL082CDR  [D0008A_N]  (parts A,B of 2)
U9  LTC660CS8#PBF  [LT-S8-8_L]

### Nets
+5: C34.1 C35.1 U9.8(V+)
-5: C31.1(C) C36.1 C37.1 R21.1 U8.4(VCC-) U9.5(VOUT)
GND: C31.2(A) C32.2 C36.2 C37.2 J6.1 J6.MH1 J6.MH2 R19.2 U8.5(IN2+) U9.3(GND) U9.6(LV)
pH Sig: R22.2 U8.7(OUT2) ; off-sheet pH Sig
NetC30_1: C30.1(C) U9.4(CAP-)
NetC30_2: C30.2(A) U9.2(CAP+)
NetC32_1: C32.1 R17.2 U8.3(IN1+)
NetC33_1: C33.1 GAIN.2(WIPER) U8.2(IN1-)
NetC33_2: C33.2 R18.1 R20.1 U8.1(OUT1)
NetC34_2: C34.2 C35.2 U8.8(VCC+)
NetGAIN_1: GAIN.1(CCW) R18.2
NetGAIN_3: GAIN.3(CW) R19.1
NetJ6_2: J6.2 R17.1
NetR20_2: R20.2 R21.2 R22.1 U8.6(IN2-)

Not connected (* = marked no-connect by the designer): U9 1(BOOST)* 7(OSC)*

### Notes on the sheet
- (in symbol CMP-05428-001128-1) +

### Library data of the parts
C30 C31 = CMP-05428-001128-1: Molded Tantalum Polymer Capacitor 150uF 20% 10V life 2000Hours SMD 2917; ESR (Equivalent Series Resistance): 15mR; Dissipation Factor: 10%; Polarity: Polar; Ripple Current: 3.6A; Leakage Current: 150uA; Tolerance: 20%; Voltage Rating: 10V; Height: 2.8mm; Case Code (Metric): 7343; Max Operating Temperature: 105°C; Features: General Purpose; Construction: Flat; Mount: Surface Mount; REACH SVHC: No SVHC; Packaging: Tape and Reel; Termination: SMD/SMT; Lead Free: Lead Free; Case Code (Imperial): 2917; Voltage: 10V; Min Operating Temperature: -55°C; Capacitance: 150uF; Series: POSCAP™ TPF; Length: 7.3mm; Radiation Hardening: No; Width: 4.3mm; RoHS Compliant: Yes; Package Quantity: 2500; Case/Package: 2917; Height - Seated (Max): 0.118inch; Depth: 4.3mm; Voltage Rating (DC): 10V
C32 = CMP-06035-056041-1: Chip Multilayer Ceramic Capacitors for General Purpose, 0603, 2200pF, C0G, 30ppm/°C, 5%, 50V; Insulation Resistance: 10GR; Min Operating Temperature: -55°C; Voltage: 50V; Tolerance: 5%; Height: 0.8mm; Packaging: Tape and Reel; Length: 1.6mm; Mount: Surface Mount; Temperature Coefficient: 30ppm/°C; Case Code (Metric): 1608; Case/Package: 0603; Lead Free: Lead Free; Voltage Rating: 50V; Termination: SMD/SMT; Max Operating Temperature: 125°C; Voltage Rating (DC): 50V; Number of Pins: 2; Dielectric: C0G; Material: Ceramic; Thickness: 0.035inch; REACH SVHC: No SVHC; Dielectric Material: Ceramic; Case Code (Imperial): 0603; Radiation Hardening: No; Package Quantity: 1; Capacitance: 2.2nF; Width: 0.8mm; Depth: 0.8mm
C33 = CMP-2000-05447-3: as C21 on sheet TDS; Height: 0.8mm; Depth: 0.8mm; Number of Pins: 2; Length: 1.6mm; Thickness: 0.035inch; Contact Plating: Nickel; Radiation Hardening: No; Package Quantity: 1; Case/Package: 0603; Capacitance: 1uF; Halogen Free: Halogen Free; RoHS Compliant: Yes; Termination: SMD/SMT; Max Operating Temperature: 85°C; Min Operating Temperature: -55°C; Case Code (Metric): 1608; Construction: Flat; Voltage Rating (DC): 50V; Packaging: Tape and Reel; Series: M; Case Code (Imperial): 0603; Width: 0.031inch; Mount: Surface Mount
C34 C36 = CMP-2007-03243-2: as C4 on sheet PowerSupply; Device Class L2: Capacitors; Device Class L1: Passive Components; ComponentLink2URL: https://content.kemet.com/datasheets/KEM_C1006_X5R_SMD.pdf; Height: 1.4mm; Lead Free: Yes; Digikey Description: CAP CER 10UF 10V X5R 0805; Octopart: https://octopart.com/c0805c106k8pactu-kemet-98697; Capacitance: 10uF; Value: 10uF; Temperature Range Low: -55°C; Temperature: -55°C to +85°C; Automotive: No; Mouser Description: CAP CER 10UF 10V X5R 0805; Ipc Land Pattern Name: CAPC200125X125; Temperature Range High: +85°C; Voltage: 10V; RoHS: TRUE; Device Class L3: Ceramic Capacitors; ComponentLink2Description: Datasheet; Voltage Rating: 10V; Package: C0805C-DG; Temperature Characteristic: X5R; Category: Cap
C35 C37 = CMP-2000-07546-2: as C13 on sheet TDS; Weight: 7.1E-05oz; Composition: Ceramic; Max Operating Temperature: 125°C; Termination: SMD/SMT; Dielectric: X7R; Length: 1.6mm; Package Quantity: 1; REACH SVHC: No SVHC; Lead Free: Lead Free; Case Code (Metric): 1608; Min Operating Temperature: -55°C; Packaging: Tape and Reel; Tolerance: 10%; Voltage Rating: 50V; Case Code (Imperial): 0603; Capacitance: 100nF; Case/Package: 0603; Voltage Rating (DC): 50V; Depth: 0.8mm; Radiation Hardening: No; Ratings: AEC-Q200; Mount: Surface Mount; Voltage: 50V; Thickness: 0.035inch; Width: 0.8mm; Height: 0.8mm
GAIN = 3296Y-1-502LF: Variable Resistor; Manufacturer_Name: Bourns; Datasheet Link: http://uk.rs-online.com/web/p/products/5220215; Height: 10.03mm; Manufacturer_Part_Number: 3296Y-1-502LF; Mouser Part Number: 652-3296Y-1-502LF; Mouser Price/Stock: https://www.mouser.co.uk/ProductDetail/Bourns/3296Y-1-502LF?qs=T7l%2FPuJnbcQ857qUhxMrRA%3D%3D; Arrow Part Number: 3296Y-1-502LF; Arrow Price/Stock: https://www.arrow.com/en/products/3296y-1-502lf/bourns?region=europe
J6 = CMP-2000-05853-1: Female Connector, Pitch 2.54 mm, 1 x 2 Position, Height 15.8 mm, Tail Length 3.8 mm, / -55 to 85 degC, RoHS, Bulk; Manufacturer: TE Connectivity; Connector Body Style: RightAngleJack; Frequency Max: 4GHz; Coaxial Termination: Solder; Connector Mounting: PCBMount; SVHC: ToBeAdvised; Connector Type: BNCCoaxial; Impedance: 50ohm; Coaxial Cable Types: -; Manufacturer URL: http://www.te.com/; Package Reference: 1-1337543-0; Product Range: -; Datasheet URL: http://www.te.com/commerce/DocumentDelivery/DDEController?Action=showdoc&DocId=Customer+Drawing%7F1337543%7FG%7Fpdf%7FEnglish%7FENG_CD_1337543_G.pdf%7F1-1337543-0; Contact Plating: GoldPlatedContacts; Mounting Technology: ThroughHole; Package Description: Female Connector, Pitch 2.54 mm, 1 x 2 Position, Height 15.8 mm, Tail Length 3.8 mm; Contact Material: Brass; Datasheet Version: Rev. G, 12/2012
R17 = CMP-2000-03425-1: Manufacturer: Vishay Dale; Part Number: CRCW06034M70FKEA
R18 = CMP-2000-00955-1: Manufacturer: Panasonic; Part Number: ERA3AEB222V
R19 = CMP-1013-00510-2: as R1 on sheet PowerSupply
R20 R22 = CMP-2000-03223-1: Part Number: CRCW060330K0FKEA; Manufacturer: Vishay Dale
R21 = CMP-2000-00124-2: RES SMD 75K OHM 0.1% 1/10W 0603; Manufacturer: Panasonic; Manufacturer Part Number: ERA-3AEB753V; Voltage Rating: 75V; Resistance: 75kΩ; Power Rating: 0.1W; Automotive Grade: Grade 0; Value: 75kΩ; Temperature Coefficient: 25ppm/°C; Ipc Land Pattern Name: RESC16080X45; Device Class L3: Chip SMD Resistors; Composition: Metal Film; Footprint Url: https://industrial.panasonic.com/cdbs/www-data/pdf/RDM0000/DMM0000COL17.pdf; Temperature: -55°C to +155°C; Automotive: Yes; Lead Free: Yes; Device Class L2: Resistors; Package: ERA3A; Octopart: https://octopart.com/era-3aeb753v-panasonic-1225046; Device Class L1: Passive Components; ComponentLink2Description: Datasheet; Temperature Range Low: -55°C; Series: ERA; ComponentLink2URL: https://industrial.panasonic.com/cdbs/www-data/pdf/RDM0000/AOA0000C307.pdf; RoHS: TRUE; Temperature Range High: +155°C; Category: Res; Height: 0.55mm; Digikey Description: RES SMD 75K OHM 0.1% 1/10W 0603; Tolerance: 0.1%; Mouser Description: Thin Film Resistors - SMD 0603 1/10W 75Kohms
U8 = CMP-0017-00394-2: JFET-Input Operational Amplifier, 7 to 36 V, 0 to 70 degC, 8-pin SOIC (D8), Green (RoHS & no Sb/Br); Manufacturer: Texas Instruments; Total Supply Voltage(Min)(+5V is 5, +/-5V is 10): 7; Iq per channel(Max)(mA): 2.8; Total Supply Voltage(Max)(+5V is 5, +/-5V is 10): 36; GBW(Typ)(MHz): 3; Number of Channels: 2; IIB(Max)(pA): 400; CMRR(Min)(dB): 70; Offset Drift(Typ)(uV/C): 18; Rating: Catalog; Vio (25C)(Max)(mV): 15; Sub Family: General Purpose Amplifier, High Supply Voltage Amplifier (>=30V); Slew Rate(Typ)(V/us): 13; ComponentLink3Description: Package Specification; PackageReference: D0008A; Mounting Technology: Surface Mount; Code_JEDEC: MS-012; ComponentLink1URL: http://www.ti.com/; ComponentLink2URL: http://www.ti.com/lit/ds/symlink/tl082.pdf; DatasheetVersion: SLOS081G; PartNumber: TL082CDR; PackageVersion: 4040047-3/M, 06/2011; ComponentLink1Description: Manufacturer URL; Eco-Plan: Green (RoHS & no Sb/Br); Vn at 1kHz(Typ)(nV/rtHz): 18; ComponentLink2Description: Datasheet; PackageDescription: 8-Pin Plastic Small Outline, Body 4.9 x 3.9 mm, Pitch 1.27 mm; ComponentLink3URL: http://www.ti.com/litv/pdf/msoi002j
U9 = CMP-0475-00376-1: 100 mA CMOS Voltage Converter, 1.5 to 5.5 V Vin, 8-pin SOIC (S8-8), 0 to 70 degC, Pb-Free; Manufacturer: Linear Technology; Frequency(kHz): 80; Vin Min(V): 1.5; Ishutdown(uA): 1; Voutput: -VIN, 2VIN; Isupply(mA): 0.23; Vin Max(V): 5.5; ComponentLink1Description: Manufacturer URL; PackageVersion: Rev. G, 03/2012; PackageReference: S8-8; PartNumber: LTC660CS8#PBF; ComponentLink2Description: Datasheet; PackageDescription: 8-Pin Plastic Small Outline (Narrow .150 Inch), Body 4.9 x 3.9 mm, Pitch 1.27 mm; ComponentLink2URL: http://cds.linear.com/docs/en/datasheet/660fa.pdf; ComponentLink3URL: http://cds.linear.com/docs/en/packaging/05081610_G_SO8.pdf; Mounting Technology: Surface Mount; ComponentLink3Description: Package Specification; ComponentLink1URL: http://www.linear.com/; RoHS: TRUE; DatasheetVersion: Rev. A

## Nets that join several sheets
+3.3: PowerSupply (C4.1 R23.2 U2.4), Processor (C5.1 C6.1 MD1.2 R2.1)
+5: PowerSupply (5 pins), Processor (5 pins), MotorController (U3.16), TDS (C13.1 U4.3), PH (C34.1 C35.1 U9.8)
+12: PowerSupply (C1.1 J1.1 U1.1), MotorController (U3.8)
GND: PowerSupply (10 pins), Processor (16 pins), MotorController (10 pins), TDS (23 pins), PH (11 pins)
1A: Processor (MD1.24), MotorController (U3.2)
2A: Processor (MD1.26), MotorController (U3.7)
3A: Processor (MD1.28), MotorController (U3.10)
EN 1,2: Processor (MD1.29), MotorController (U3.1)
EN 3,4: Processor (MD1.27), MotorController (U3.9)
pH Sig: Processor (MD1.6), PH (R22.2 U8.7)
TDS Sig: Processor (MD1.9), TDS (C22.1 D7.2 R12.2)